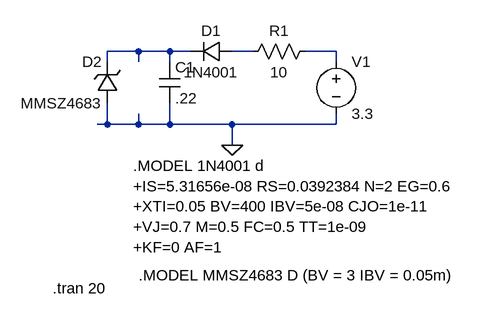
[diagram p0: schematic CapacitorPowerCharger.asc]
CapacitorPowerCharger.asc, the LTspice schematic file:
Version 4
SHEET 1 880 680
WIRE 96 -352 48 -352
WIRE 144 -352 96 -352
WIRE 176 -352 144 -352
WIRE 272 -352 240 -352
WIRE 400 -352 352 -352
WIRE 48 -336 48 -352
WIRE 96 -336 96 -352
WIRE 144 -336 144 -352
WIRE 400 -336 400 -352
WIRE 48 -240 48 -272
WIRE 48 -240 32 -240
WIRE 96 -240 96 -256
WIRE 96 -240 48 -240
WIRE 144 -240 144 -272
WIRE 144 -240 96 -240
WIRE 240 -240 144 -240
WIRE 400 -240 400 -256
WIRE 400 -240 240 -240
WIRE 240 -208 240 -240
FLAG 240 -208 0
SYMBOL voltage 400 -352 R0
WINDOW 123 0 0 Left 2
WINDOW 39 0 0 Left 2
SYMATTR InstName V1
SYMATTR Value 3.3
SYMBOL zener 64 -272 R180
WINDOW 0 24 64 Left 2
WINDOW 3 24 0 Left 2
SYMATTR InstName D2
SYMATTR Value MMSZ4683
SYMBOL res 368 -368 R90
WINDOW 0 0 56 VBottom 2
WINDOW 3 32 56 VTop 2
SYMATTR InstName R1
SYMATTR Value 10
SYMBOL cap 128 -336 R0
SYMATTR InstName C1
SYMATTR Value .22
SYMATTR SpiceLine IC = 0
SYMBOL diode 240 -368 R90
WINDOW 0 0 32 VBottom 2
WINDOW 3 32 32 VTop 2
SYMATTR InstName D1
SYMATTR Value 1N4001
TEXT 88 -176 Left 2 !.MODEL 1N4001 d\n+IS=5.31656e-08 RS=0.0392384 N=2 EG=0.6\n+XTI=0.05 BV=400 IBV=5e-08 CJO=1e-11\n+VJ=0.7 M=0.5 FC=0.5 TT=1e-09\n+KF=0 AF=1
TEXT 96 -8 Left 2 !.MODEL MMSZ4683 D (BV = 3 IBV = 0.05m)
TEXT -36 12 Left 2 !.tran 20

The netlist it stands for:
* CapacitorPowerCharger.asc
V1 N003 0 3.3
D2 0 N001 MMSZ4683
R1 N003 N002 10
C1 N001 0 .22 IC = 0
D1 N002 N001 1N4001
.model D D
.lib standard.dio
.MODEL 1N4001 d
+IS=5.31656e-08 RS=0.0392384 N=2 EG=0.6
+XTI=0.05 BV=400 IBV=5e-08 CJO=1e-11
+VJ=0.7 M=0.5 FC=0.5 TT=1e-09
+KF=0 AF=1
.MODEL MMSZ4683 D (BV = 3 IBV = 0.05m)
.tran 20
.backanno
.end